# EAGLE schematic PCB_0.2 (EAGLE 7.1.0)
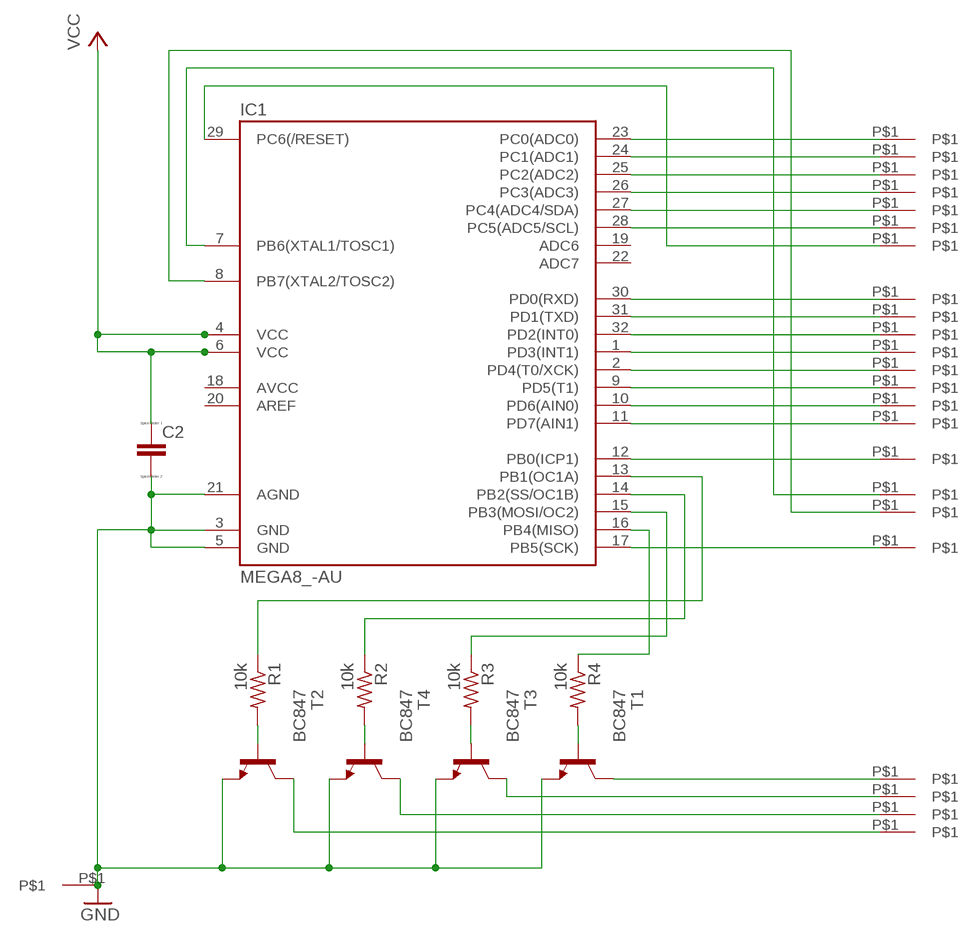
[diagram p0: schematic, sheet 1]

## Parts
C2  C-EUC0603K  [C0603K]
IC1  MEGA8_-AU  [TQFP32-08]
PC0  Fahrkanal  PAD  [PAD]
PC1  Fahrkanal  PAD  [PAD]
PC2  Fahrkanal  PAD  [PAD]
PC3  Fahrkanal  PAD  [PAD]
PC4  Fahrkanal  PAD  [PAD]
PC5  Fahrkanal  PAD  [PAD]
R1  10k  R-US_R0402  [R0402]
R2  10k  R-US_R0402  [R0402]
R3  10k  R-US_R0402  [R0402]
R4  10k  R-US_R0402  [R0402]
T1  BC847  [SOT23]
T2  BC847  [SOT23]
T3  BC847  [SOT23]
T4  BC847  [SOT23]
U$1  PAD  [PAD]
U$2  PAD  [PAD]
U$3  PAD  [PAD]
U$4  PAD  [PAD]
U$5  PAD  [PAD]
U$6  PAD  [PAD]
U$7  PAD  [PAD]
U$8  PAD  [PAD]
U$9  PAD  [PAD]
U$10  PAD  [PAD]
U$11  PAD  [PAD]
U$12  PAD  [PAD]
U$14  PAD  [PAD]
U$15  PAD  [PAD]
U$16  PAD  [PAD]
U$17  PAD  [PAD]
U$18  PAD  [PAD]
U$19  PAD  [PAD]

## Nets
GND: C2.2 IC1.3(GND) IC1.5(GND) IC1.21(AGND) PC5.P$1 T1.2(E) T2.2(E) T3.2(E) T4.2(E)
N$1: PC1.P$1 T1.3(C)
N$2: PC2.P$1 T3.3(C)
N$3: PC3.P$1 T4.3(C)
N$4: PC4.P$1 T2.3(C)
N$5: IC1.16(PB4(MISO)) R4.1
N$6: IC1.15(PB3(MOSI/OC2)) R3.1
N$7: IC1.14(PB2(SS/OC1B)) R2.1
N$8: IC1.13(PB1(OC1A)) R1.1
N$9: IC1.17(PB5(SCK)) U$19.P$1
N$10: IC1.23(PC0(ADC0)) PC0.P$1
N$11: IC1.24(PC1(ADC1)) U$2.P$1
N$12: IC1.25(PC2(ADC2)) U$3.P$1
N$13: IC1.26(PC3(ADC3)) U$4.P$1
N$14: IC1.27(PC4(ADC4/SDA)) U$5.P$1
N$15: IC1.28(PC5(ADC5/SCL)) U$6.P$1
N$16: IC1.29(PC6(/RESET)) U$7.P$1
N$17: IC1.30(PD0(RXD)) U$8.P$1
N$18: IC1.31(PD1(TXD)) U$9.P$1
N$19: IC1.32(PD2(INT0)) U$10.P$1
N$20: IC1.1(PD3(INT1)) U$11.P$1
N$21: IC1.2(PD4(T0/XCK)) U$12.P$1
N$22: IC1.10(PD6(AIN0)) U$14.P$1
N$23: IC1.9(PD5(T1)) U$1.P$1
N$24: IC1.11(PD7(AIN1)) U$15.P$1
N$25: IC1.12(PB0(ICP1)) U$16.P$1
N$26: R1.2 T2.1(B)
N$27: IC1.7(PB6(XTAL1/TOSC1)) U$17.P$1
N$28: IC1.8(PB7(XTAL2/TOSC2)) U$18.P$1
N$30: R3.2 T3.1(B)
N$31: R2.2 T4.1(B)
N$41: R4.2 T1.1(B)
VCC: C2.1 IC1.4(VCC) IC1.6(VCC)
Unconnected: IC1.18(AVCC) IC1.19(ADC6) IC1.20(AREF) IC1.22(ADC7)

## Library data of the parts
C2 = resistor:C-EU: CAPACITOR, European symbol; SPICEPREFIX: C
IC1 = avr-7:MEGA8_
PC0 PC1-PC5 U$1-U$12 U$14-U$19 = Pad:PAD
R1-R4 = rcl:R-US_: RESISTOR, American symbol
T1-T4 = transistor-neu-to92:BC847: NPN TRANSISTOR